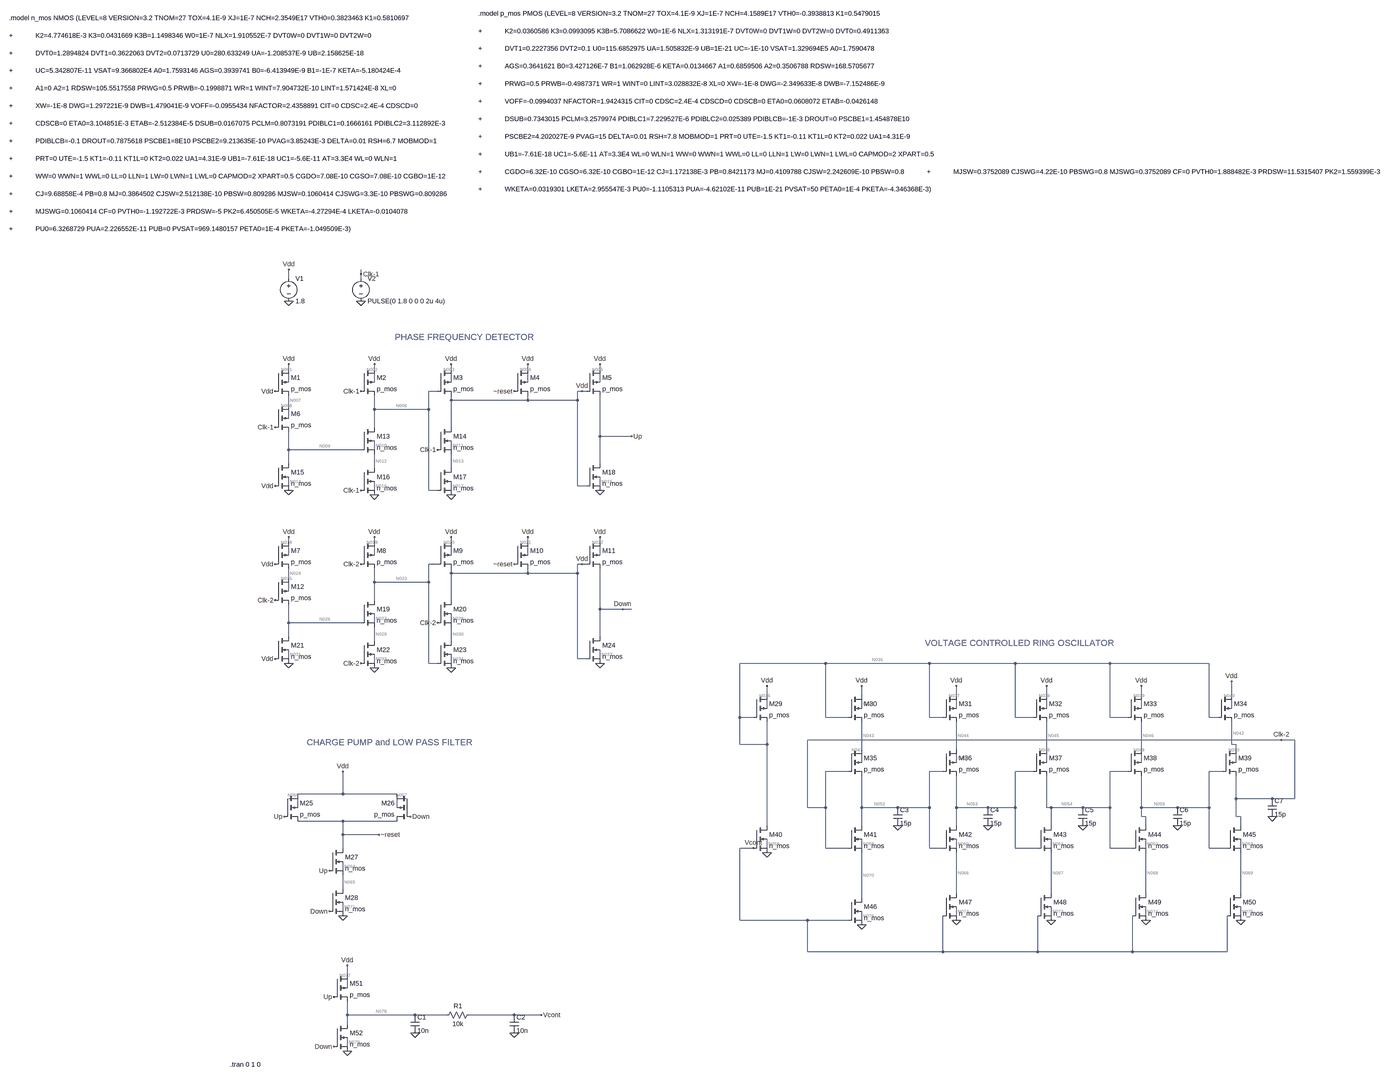
[diagram p0: schematic On-chip_PLL.asc, whole sheet]
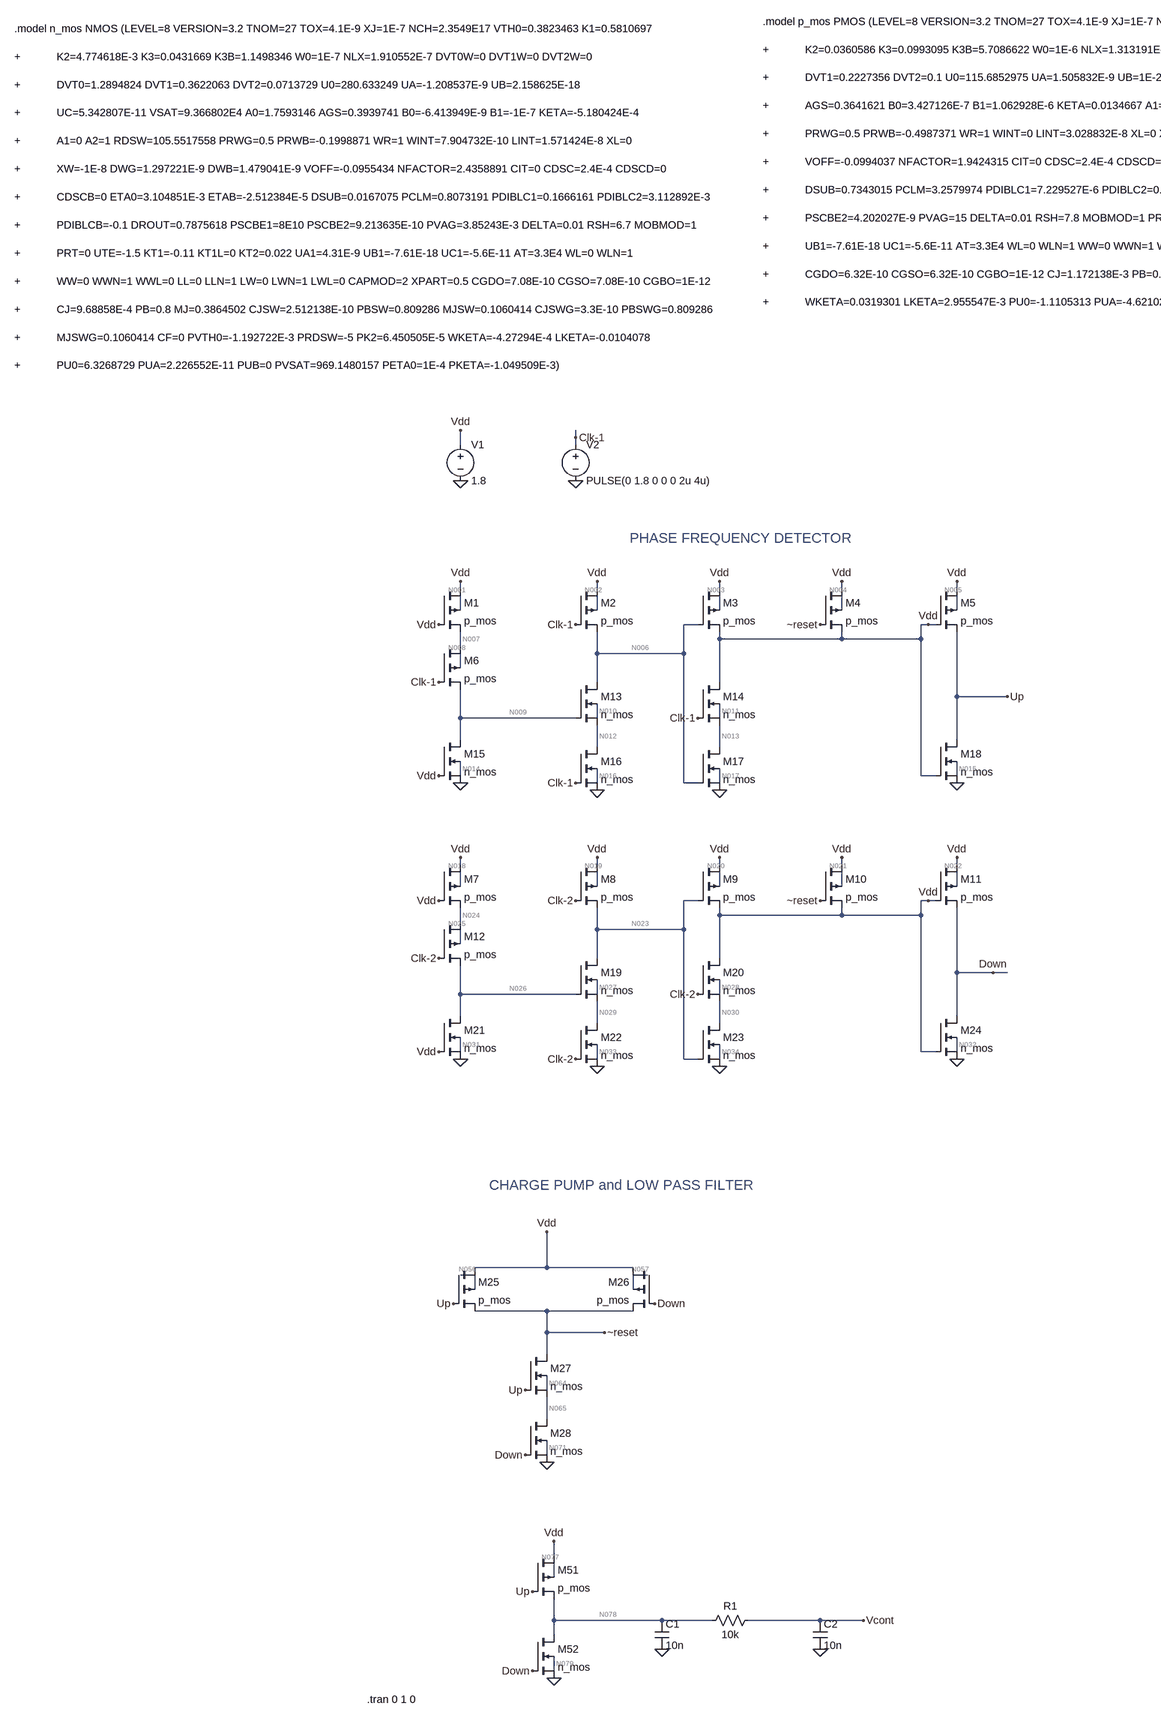
[diagram p1: schematic On-chip_PLL.asc, part, row 1 of 1, column 1 of 2]
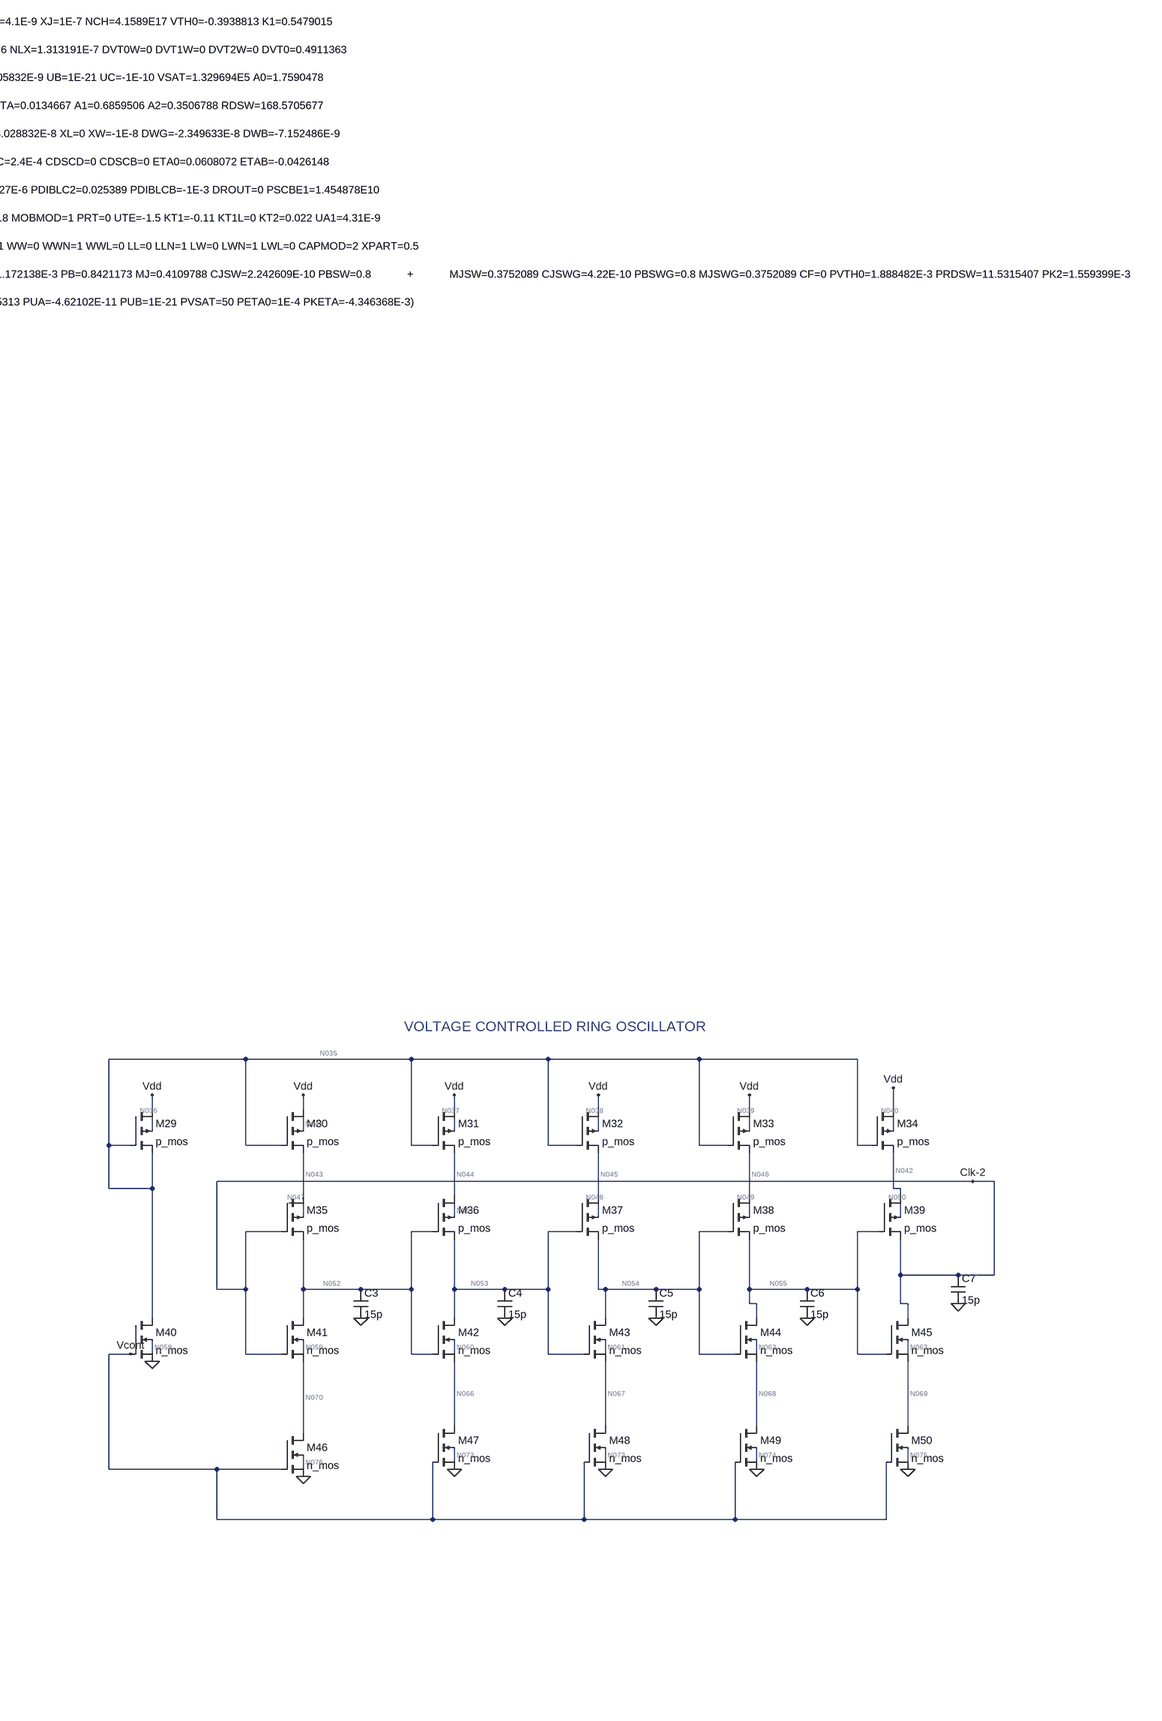
[diagram p2: schematic On-chip_PLL.asc, part, row 1 of 1, column 2 of 2]
On-chip_PLL.asc, the LTspice schematic file:
Version 4
SHEET 1 3912 2176
WIRE 80 -704 80 -720
WIRE -176 -688 -176 -720
WIRE 80 -688 80 -704
WIRE -176 -368 -176 -384
WIRE 128 -368 128 -384
WIRE 400 -368 400 -384
WIRE 672 -368 672 -384
WIRE 928 -368 928 -384
WIRE -176 -352 -192 -352
WIRE 128 -352 112 -352
WIRE 400 -352 384 -352
WIRE 672 -352 656 -352
WIRE 928 -352 912 -352
WIRE -176 -320 -176 -352
WIRE 128 -320 128 -352
WIRE 400 -320 400 -352
WIRE 672 -320 672 -352
WIRE 928 -320 928 -352
WIRE 352 -288 320 -288
WIRE 864 -288 848 -288
WIRE 880 -288 864 -288
WIRE 400 -256 400 -272
WIRE 672 -256 672 -272
WIRE 672 -256 400 -256
WIRE 848 -256 848 -288
WIRE 848 -256 672 -256
WIRE -176 -240 -176 -272
WIRE -176 -224 -192 -224
WIRE 128 -224 128 -272
WIRE 320 -224 320 -288
WIRE 320 -224 128 -224
WIRE -176 -192 -176 -224
WIRE 128 -160 128 -224
WIRE 400 -160 400 -256
WIRE 928 -128 928 -272
WIRE 1040 -128 928 -128
WIRE -176 -80 -176 -144
WIRE 80 -80 -176 -80
WIRE 128 -80 128 -112
WIRE 128 -80 112 -80
WIRE 400 -80 400 -112
WIRE 400 -80 384 -80
WIRE -176 -32 -176 -80
WIRE 928 -32 928 -128
WIRE 128 -16 128 -64
WIRE 400 -16 400 -64
WIRE -176 48 -176 16
WIRE -176 48 -192 48
WIRE 848 48 848 -256
WIRE 880 48 848 48
WIRE 928 48 928 16
WIRE 928 48 912 48
WIRE 128 64 128 32
WIRE 128 64 112 64
WIRE 320 64 320 -224
WIRE 352 64 320 64
WIRE 400 64 400 32
WIRE 400 64 384 64
WIRE -176 304 -176 288
WIRE 128 304 128 288
WIRE 400 304 400 288
WIRE 672 304 672 288
WIRE 928 304 928 288
WIRE -176 320 -192 320
WIRE 128 320 112 320
WIRE 400 320 384 320
WIRE 672 320 656 320
WIRE 928 320 912 320
WIRE -176 352 -176 320
WIRE 128 352 128 320
WIRE 400 352 400 320
WIRE 672 352 672 320
WIRE 928 352 928 320
WIRE 352 384 320 384
WIRE 864 384 848 384
WIRE 880 384 864 384
WIRE 400 416 400 400
WIRE 672 416 672 400
WIRE 672 416 400 416
WIRE 848 416 848 384
WIRE 848 416 672 416
WIRE -176 432 -176 400
WIRE -176 448 -192 448
WIRE 128 448 128 400
WIRE 320 448 320 384
WIRE 320 448 128 448
WIRE -176 480 -176 448
WIRE 128 512 128 448
WIRE 400 512 400 416
WIRE 928 544 928 400
WIRE 1008 544 928 544
WIRE 1040 544 1008 544
WIRE -176 592 -176 528
WIRE 80 592 -176 592
WIRE 128 592 128 560
WIRE 128 592 112 592
WIRE 400 592 400 560
WIRE 400 592 384 592
WIRE -176 640 -176 592
WIRE 928 640 928 544
WIRE 128 656 128 608
WIRE 400 656 400 608
WIRE -176 720 -176 688
WIRE -176 720 -192 720
WIRE 848 720 848 416
WIRE 880 720 848 720
WIRE 928 720 928 688
WIRE 928 720 912 720
WIRE 128 736 128 704
WIRE 128 736 112 736
WIRE 320 736 320 448
WIRE 352 736 320 736
WIRE 400 736 400 704
WIRE 400 736 384 736
WIRE 1728 736 1424 736
WIRE 2096 736 1728 736
WIRE 2400 736 2096 736
WIRE 2736 736 2400 736
WIRE 3088 736 2736 736
WIRE 1520 848 1520 816
WIRE 1856 848 1856 816
WIRE 2192 848 2192 816
WIRE 2512 848 2512 816
WIRE 2848 848 2848 816
WIRE 3168 848 3168 800
WIRE 1520 864 1504 864
WIRE 2192 864 2176 864
WIRE 2512 864 2496 864
WIRE 2848 864 2832 864
WIRE 3168 864 3152 864
WIRE 1520 896 1520 864
WIRE 1856 896 1856 864
WIRE 2192 896 2192 864
WIRE 2512 896 2512 864
WIRE 2848 896 2848 864
WIRE 3168 896 3168 864
WIRE 1424 928 1424 736
WIRE 1472 928 1424 928
WIRE 1728 928 1728 736
WIRE 1808 928 1728 928
WIRE 2096 928 2096 736
WIRE 2144 928 2096 928
WIRE 2400 928 2400 736
WIRE 2464 928 2400 928
WIRE 2736 928 2736 736
WIRE 2800 928 2736 928
WIRE 3088 928 3088 736
WIRE 3120 928 3088 928
WIRE 3344 1008 1664 1008
WIRE 3392 1008 3344 1008
WIRE 1424 1024 1424 928
WIRE 1520 1024 1520 944
WIRE 1520 1024 1424 1024
WIRE 3168 1024 3168 944
WIRE 3184 1024 3168 1024
WIRE 1856 1040 1856 944
WIRE 2192 1040 2192 944
WIRE 2512 1040 2512 944
WIRE 2848 1040 2848 944
WIRE 3184 1040 3184 1024
WIRE 1856 1056 1824 1056
WIRE 2512 1056 2496 1056
WIRE 2848 1056 2832 1056
WIRE 3184 1056 3168 1056
WIRE 1856 1088 1856 1056
WIRE 2192 1088 2192 1056
WIRE 2512 1088 2512 1056
WIRE 2848 1088 2848 1056
WIRE 3184 1088 3184 1056
WIRE 1808 1120 1728 1120
WIRE 2144 1120 2096 1120
WIRE 2464 1120 2400 1120
WIRE 2800 1120 2736 1120
WIRE 3136 1120 3088 1120
WIRE 16 1200 16 1120
WIRE 16 1200 -144 1200
WIRE 208 1200 16 1200
WIRE -144 1216 -176 1216
WIRE 240 1216 208 1216
WIRE 3184 1216 3184 1136
WIRE 3312 1216 3184 1216
WIRE 3392 1216 3392 1008
WIRE 3392 1216 3312 1216
WIRE -144 1248 -144 1216
WIRE 208 1248 208 1216
WIRE 1664 1248 1664 1008
WIRE 1728 1248 1728 1120
WIRE 1728 1248 1664 1248
WIRE 1856 1248 1856 1136
WIRE 1984 1248 1856 1248
WIRE 2096 1248 2096 1120
WIRE 2096 1248 1984 1248
WIRE 2192 1248 2192 1136
WIRE 2304 1248 2192 1248
WIRE 2400 1248 2400 1120
WIRE 2400 1248 2304 1248
WIRE 2512 1248 2512 1136
WIRE 2528 1248 2512 1248
WIRE 2640 1248 2528 1248
WIRE 2736 1248 2736 1120
WIRE 2736 1248 2640 1248
WIRE 2848 1248 2848 1136
WIRE 2976 1248 2848 1248
WIRE 3088 1248 3088 1120
WIRE 3088 1248 2976 1248
WIRE 2848 1280 2848 1248
WIRE 2864 1280 2848 1280
WIRE 3184 1280 3184 1216
WIRE 3200 1280 3184 1280
WIRE 16 1296 -144 1296
WIRE 208 1296 16 1296
WIRE 1520 1312 1520 1024
WIRE 1856 1312 1856 1248
WIRE 2192 1312 2192 1248
WIRE 2528 1312 2528 1248
WIRE 2864 1312 2864 1280
WIRE 3200 1312 3200 1280
WIRE 16 1344 16 1296
WIRE 144 1344 16 1344
WIRE 16 1392 16 1344
WIRE 1472 1392 1424 1392
WIRE 1520 1392 1520 1360
WIRE 1520 1392 1504 1392
WIRE 1728 1392 1728 1248
WIRE 1808 1392 1728 1392
WIRE 1856 1392 1856 1360
WIRE 1856 1392 1840 1392
WIRE 2096 1392 2096 1248
WIRE 2144 1392 2096 1392
WIRE 2192 1392 2192 1360
WIRE 2192 1392 2176 1392
WIRE 2400 1392 2400 1248
WIRE 2480 1392 2400 1392
WIRE 2528 1392 2528 1360
WIRE 2528 1392 2512 1392
WIRE 2736 1392 2736 1248
WIRE 2816 1392 2736 1392
WIRE 2864 1392 2864 1360
WIRE 2864 1392 2848 1392
WIRE 3088 1392 3088 1248
WIRE 3152 1392 3088 1392
WIRE 3200 1392 3200 1360
WIRE 3200 1392 3184 1392
WIRE 16 1472 16 1440
WIRE 16 1536 16 1488
WIRE 2192 1552 2192 1408
WIRE 2528 1552 2528 1408
WIRE 2864 1552 2864 1408
WIRE 3200 1552 3200 1408
WIRE 1856 1568 1856 1408
WIRE 16 1616 16 1584
WIRE 2192 1632 2192 1600
WIRE 2192 1632 2176 1632
WIRE 2528 1632 2528 1600
WIRE 2528 1632 2512 1632
WIRE 2864 1632 2864 1600
WIRE 2864 1632 2848 1632
WIRE 3200 1632 3200 1600
WIRE 3200 1632 3184 1632
WIRE 1424 1648 1424 1392
WIRE 1664 1648 1424 1648
WIRE 1808 1648 1664 1648
WIRE 1856 1648 1856 1616
WIRE 1856 1648 1840 1648
WIRE 1664 1760 1664 1648
WIRE 2144 1760 2144 1632
WIRE 2144 1760 1664 1760
WIRE 2480 1760 2480 1632
WIRE 2480 1760 2144 1760
WIRE 2816 1760 2816 1632
WIRE 2816 1760 2480 1760
WIRE 3152 1760 3152 1632
WIRE 3152 1760 2816 1760
WIRE 32 1840 32 1808
WIRE 32 1856 16 1856
WIRE 32 1888 32 1856
WIRE 32 1984 32 1936
WIRE 272 1984 32 1984
WIRE 384 1984 272 1984
WIRE 624 1984 464 1984
WIRE 720 1984 624 1984
WIRE 32 2016 32 1984
WIRE 32 2096 32 2064
FLAG 1008 544 Down
FLAG 80 -704 Clk-1
FLAG -224 -160 Clk-1
FLAG 80 -288 Clk-1
FLAG 80 64 Clk-1
FLAG 352 -80 Clk-1
FLAG -224 512 Clk-2
FLAG 80 736 Clk-2
FLAG 80 384 Clk-2
FLAG 352 592 Clk-2
FLAG -224 720 Vdd
FLAG -224 384 Vdd
FLAG -224 48 Vdd
FLAG -224 -288 Vdd
FLAG -176 288 Vdd
FLAG 128 288 Vdd
FLAG 400 288 Vdd
FLAG -176 -384 Vdd
FLAG 128 -384 Vdd
FLAG 400 -384 Vdd
FLAG 672 -384 Vdd
FLAG 928 -384 Vdd
FLAG 864 -288 Vdd
FLAG 672 288 Vdd
FLAG 928 288 Vdd
FLAG 864 384 Vdd
FLAG 624 -288 ~reset
FLAG 624 384 ~reset
FLAG -176 -720 Vdd
FLAG -192 1280 Up
FLAG -32 1472 Up
FLAG -32 1616 Down
FLAG 144 1344 ~reset
FLAG 16 1120 Vdd
FLAG 1520 816 Vdd
FLAG 1856 816 Vdd
FLAG 2192 816 Vdd
FLAG 2512 816 Vdd
FLAG 2848 816 Vdd
FLAG 3168 800 Vdd
FLAG 3344 1008 Clk-2
FLAG 1472 1392 Vcont
FLAG 16 1632 0
FLAG -16 2096 Down
FLAG 720 1984 Vcont
FLAG 32 2112 0
FLAG 272 2048 0
FLAG 624 2048 0
FLAG -176 64 0
FLAG 128 80 0
FLAG 400 80 0
FLAG 928 64 0
FLAG -176 736 0
FLAG 128 752 0
FLAG 400 752 0
FLAG 928 736 0
FLAG 1520 1408 0
FLAG 1856 1664 0
FLAG 2192 1648 0
FLAG 2528 1648 0
FLAG 2864 1648 0
FLAG 3200 1648 0
FLAG -176 -608 0
FLAG 80 -608 0
FLAG 1040 -128 Up
FLAG 256 1280 Down
FLAG -16 1920 Up
FLAG 32 1808 Vdd
FLAG 1984 1312 0
FLAG 2304 1312 0
FLAG 2640 1312 0
FLAG 2976 1312 0
FLAG 3312 1280 0
SYMBOL pmos4 -224 -368 R0
SYMATTR InstName M1
SYMATTR Value p_mos
SYMBOL pmos4 80 -368 R0
SYMATTR InstName M2
SYMATTR Value p_mos
SYMBOL pmos4 352 -368 R0
SYMATTR InstName M3
SYMATTR Value p_mos
SYMBOL pmos4 624 -368 R0
SYMATTR InstName M4
SYMATTR Value p_mos
SYMBOL pmos4 880 -368 R0
SYMATTR InstName M5
SYMATTR Value p_mos
SYMBOL pmos4 -224 -240 R0
SYMATTR InstName M6
SYMATTR Value p_mos
SYMBOL nmos4 80 -160 R0
SYMATTR InstName M13
SYMATTR Value n_mos
SYMBOL nmos4 352 -160 R0
SYMATTR InstName M14
SYMATTR Value n_mos
SYMBOL nmos4 -224 -32 R0
SYMATTR InstName M15
SYMATTR Value n_mos
SYMBOL nmos4 80 -16 R0
SYMATTR InstName M16
SYMATTR Value n_mos
SYMBOL nmos4 352 -16 R0
SYMATTR InstName M17
SYMATTR Value n_mos
SYMBOL nmos4 880 -32 R0
SYMATTR InstName M18
SYMATTR Value n_mos
SYMBOL pmos4 -224 304 R0
SYMATTR InstName M7
SYMATTR Value p_mos
SYMBOL pmos4 80 304 R0
SYMATTR InstName M8
SYMATTR Value p_mos
SYMBOL pmos4 352 304 R0
SYMATTR InstName M9
SYMATTR Value p_mos
SYMBOL pmos4 624 304 R0
SYMATTR InstName M10
SYMATTR Value p_mos
SYMBOL pmos4 880 304 R0
SYMATTR InstName M11
SYMATTR Value p_mos
SYMBOL pmos4 -224 432 R0
SYMATTR InstName M12
SYMATTR Value p_mos
SYMBOL nmos4 80 512 R0
SYMATTR InstName M19
SYMATTR Value n_mos
SYMBOL nmos4 352 512 R0
SYMATTR InstName M20
SYMATTR Value n_mos
SYMBOL nmos4 -224 640 R0
SYMATTR InstName M21
SYMATTR Value n_mos
SYMBOL nmos4 80 656 R0
SYMATTR InstName M22
SYMATTR Value n_mos
SYMBOL nmos4 352 656 R0
SYMATTR InstName M23
SYMATTR Value n_mos
SYMBOL nmos4 880 640 R0
SYMATTR InstName M24
SYMATTR Value n_mos
SYMBOL voltage -176 -704 R0
WINDOW 123 0 0 Left 0
WINDOW 39 0 0 Left 0
SYMATTR InstName V1
SYMATTR Value 1.8
SYMBOL voltage 80 -704 R0
WINDOW 123 0 0 Left 0
WINDOW 39 0 0 Left 0
SYMATTR InstName V2
SYMATTR Value PULSE(0 1.8 0 0 0 2u 4u)
SYMBOL pmos4 -192 1200 R0
SYMATTR InstName M25
SYMATTR Value p_mos
SYMBOL nmos4 -32 1392 R0
SYMATTR InstName M27
SYMATTR Value n_mos
SYMBOL nmos4 -32 1536 R0
SYMATTR InstName M28
SYMATTR Value n_mos
SYMBOL pmos4 1472 848 R0
SYMATTR InstName M29
SYMATTR Value p_mos
SYMBOL pmos4 1808 848 R0
SYMATTR InstName M30
SYMATTR Value p_mos
SYMBOL pmos4 2144 848 R0
SYMATTR InstName M31
SYMATTR Value p_mos
SYMBOL pmos4 2464 848 R0
SYMATTR InstName M32
SYMATTR Value p_mos
SYMBOL pmos4 2800 848 R0
SYMATTR InstName M33
SYMATTR Value p_mos
SYMBOL pmos4 3120 848 R0
SYMATTR InstName M34
SYMATTR Value p_mos
SYMBOL pmos4 1808 1040 R0
SYMATTR InstName M35
SYMATTR Value p_mos
SYMBOL pmos4 2144 1040 R0
SYMATTR InstName M36
SYMATTR Value p_mos
SYMBOL pmos4 2464 1040 R0
SYMATTR InstName M37
SYMATTR Value p_mos
SYMBOL pmos4 2800 1040 R0
SYMATTR InstName M38
SYMATTR Value p_mos
SYMBOL pmos4 3136 1040 R0
SYMATTR InstName M39
SYMATTR Value p_mos
SYMBOL nmos4 1472 1312 R0
SYMATTR InstName M40
SYMATTR Value n_mos
SYMBOL nmos4 1808 1312 R0
SYMATTR InstName M41
SYMATTR Value n_mos
SYMBOL nmos4 2144 1312 R0
SYMATTR InstName M42
SYMATTR Value n_mos
SYMBOL nmos4 2480 1312 R0
SYMATTR InstName M43
SYMATTR Value n_mos
SYMBOL nmos4 2816 1312 R0
SYMATTR InstName M44
SYMATTR Value n_mos
SYMBOL nmos4 3152 1312 R0
SYMATTR InstName M45
SYMATTR Value n_mos
SYMBOL nmos4 1808 1568 R0
SYMATTR InstName M46
SYMATTR Value n_mos
SYMBOL nmos4 2144 1552 R0
SYMATTR InstName M47
SYMATTR Value n_mos
SYMBOL nmos4 2480 1552 R0
SYMATTR InstName M48
SYMATTR Value n_mos
SYMBOL nmos4 2816 1552 R0
SYMATTR InstName M49
SYMATTR Value n_mos
SYMBOL nmos4 3152 1552 R0
SYMATTR InstName M50
SYMATTR Value n_mos
SYMBOL nmos4 -16 2016 R0
SYMATTR InstName M52
SYMATTR Value n_mos
SYMBOL cap 256 1984 R0
SYMATTR InstName C1
SYMATTR Value 10n
SYMBOL cap 608 1984 R0
SYMATTR InstName C2
SYMATTR Value 10n
SYMBOL res 480 1968 R90
WINDOW 0 0 56 VBottom 2
WINDOW 3 32 56 VTop 2
SYMATTR InstName R1
SYMATTR Value 10k
SYMBOL pmos4 256 1200 M0
SYMATTR InstName M26
SYMATTR Value p_mos
SYMBOL pmos4 -16 1840 R0
SYMATTR InstName M51
SYMATTR Value p_mos
SYMBOL cap 1968 1248 R0
SYMATTR InstName C3
SYMATTR Value 15p
SYMBOL cap 2288 1248 R0
SYMATTR InstName C4
SYMATTR Value 15p
SYMBOL cap 2624 1248 R0
SYMATTR InstName C5
SYMATTR Value 15p
SYMBOL cap 2960 1248 R0
SYMATTR InstName C6
SYMATTR Value 15p
SYMBOL cap 3296 1216 R0
SYMATTR InstName C7
SYMATTR Value 15p
TEXT 200 -480 Left 3 ;PHASE FREQUENCY DETECTOR
TEXT -112 1016 Left 3 ;CHARGE PUMP and LOW PASS FILTER
TEXT 2080 664 Left 3 ;VOLTAGE CONTROLLED RING OSCILLATOR
TEXT -384 2160 Left 2 !.tran 0 1 0
TEXT -1168 -1848 Left 2 !.model n_mos NMOS (LEVEL=8 VERSION=3.2 TNOM=27 TOX=4.1E-9 XJ=1E-7 NCH=2.3549E17 VTH0=0.3823463 K1=0.5810697 \n \n+            K2=4.774618E-3 K3=0.0431669 K3B=1.1498346 W0=1E-7 NLX=1.910552E-7 DVT0W=0 DVT1W=0 DVT2W=0 \n \n+            DVT0=1.2894824 DVT1=0.3622063 DVT2=0.0713729 U0=280.633249 UA=-1.208537E-9 UB=2.158625E-18\n \n+            UC=5.342807E-11 VSAT=9.366802E4 A0=1.7593146 AGS=0.3939741 B0=-6.413949E-9 B1=-1E-7 KETA=-5.180424E-4\n \n+            A1=0 A2=1 RDSW=105.5517558 PRWG=0.5 PRWB=-0.1998871 WR=1 WINT=7.904732E-10 LINT=1.571424E-8 XL=0\n \n+            XW=-1E-8 DWG=1.297221E-9 DWB=1.479041E-9 VOFF=-0.0955434 NFACTOR=2.4358891 CIT=0 CDSC=2.4E-4 CDSCD=0\n \n+            CDSCB=0 ETA0=3.104851E-3 ETAB=-2.512384E-5 DSUB=0.0167075 PCLM=0.8073191 PDIBLC1=0.1666161 PDIBLC2=3.112892E-3    \n \n+            PDIBLCB=-0.1 DROUT=0.7875618 PSCBE1=8E10 PSCBE2=9.213635E-10 PVAG=3.85243E-3 DELTA=0.01 RSH=6.7 MOBMOD=1\n \n+            PRT=0 UTE=-1.5 KT1=-0.11 KT1L=0 KT2=0.022 UA1=4.31E-9 UB1=-7.61E-18 UC1=-5.6E-11 AT=3.3E4 WL=0 WLN=1\n \n+            WW=0 WWN=1 WWL=0 LL=0 LLN=1 LW=0 LWN=1 LWL=0 CAPMOD=2 XPART=0.5 CGDO=7.08E-10 CGSO=7.08E-10 CGBO=1E-12\n \n+            CJ=9.68858E-4 PB=0.8 MJ=0.3864502 CJSW=2.512138E-10 PBSW=0.809286 MJSW=0.1060414 CJSWG=3.3E-10 PBSWG=0.809286 \n \n+            MJSWG=0.1060414 CF=0 PVTH0=-1.192722E-3 PRDSW=-5 PK2=6.450505E-5 WKETA=-4.27294E-4 LKETA=-0.0104078 \n \n+            PU0=6.3268729 PUA=2.226552E-11 PUB=0 PVSAT=969.1480157 PETA0=1E-4 PKETA=-1.049509E-3)
TEXT 496 -1864 Left 2 !.model p_mos PMOS (LEVEL=8 VERSION=3.2 TNOM=27 TOX=4.1E-9 XJ=1E-7 NCH=4.1589E17 VTH0=-0.3938813 K1=0.5479015\n \n+            K2=0.0360586 K3=0.0993095 K3B=5.7086622 W0=1E-6 NLX=1.313191E-7 DVT0W=0 DVT1W=0 DVT2W=0 DVT0=0.4911363\n \n+            DVT1=0.2227356 DVT2=0.1 U0=115.6852975 UA=1.505832E-9 UB=1E-21 UC=-1E-10 VSAT=1.329694E5 A0=1.7590478\n \n+            AGS=0.3641621 B0=3.427126E-7 B1=1.062928E-6 KETA=0.0134667 A1=0.6859506 A2=0.3506788 RDSW=168.5705677\n \n+            PRWG=0.5 PRWB=-0.4987371 WR=1 WINT=0 LINT=3.028832E-8 XL=0 XW=-1E-8 DWG=-2.349633E-8 DWB=-7.152486E-9 \n \n+            VOFF=-0.0994037 NFACTOR=1.9424315 CIT=0 CDSC=2.4E-4 CDSCD=0 CDSCB=0 ETA0=0.0608072 ETAB=-0.0426148\n \n+            DSUB=0.7343015 PCLM=3.2579974 PDIBLC1=7.229527E-6 PDIBLC2=0.025389 PDIBLCB=-1E-3 DROUT=0 PSCBE1=1.454878E10\n \n+            PSCBE2=4.202027E-9 PVAG=15 DELTA=0.01 RSH=7.8 MOBMOD=1 PRT=0 UTE=-1.5 KT1=-0.11 KT1L=0 KT2=0.022 UA1=4.31E-9\n \n+            UB1=-7.61E-18 UC1=-5.6E-11 AT=3.3E4 WL=0 WLN=1 WW=0 WWN=1 WWL=0 LL=0 LLN=1 LW=0 LWN=1 LWL=0 CAPMOD=2 XPART=0.5\n \n+            CGDO=6.32E-10 CGSO=6.32E-10 CGBO=1E-12 CJ=1.172138E-3 PB=0.8421173 MJ=0.4109788 CJSW=2.242609E-10 PBSW=0.8            +            MJSW=0.3752089 CJSWG=4.22E-10 PBSWG=0.8 MJSWG=0.3752089 CF=0 PVTH0=1.888482E-3 PRDSW=11.5315407 PK2=1.559399E-3    \n \n+            WKETA=0.0319301 LKETA=2.955547E-3 PU0=-1.1105313 PUA=-4.62102E-11 PUB=1E-21 PVSAT=50 PETA0=1E-4 PKETA=-4.346368E-3)

The netlist it stands for:
* On-chip_PLL.asc
M1 Vdd Vdd N007 N001 p_mos
M2 Vdd Clk-1 N006 N002 p_mos
M3 Vdd N006 Vdd N003 p_mos
M4 Vdd ~reset Vdd N004 p_mos
M5 Vdd Vdd Up N005 p_mos
M6 N007 Clk-1 N009 N008 p_mos
M13 N006 N009 N012 N010 n_mos
M14 Vdd Clk-1 N013 N011 n_mos
M15 N009 Vdd 0 N014 n_mos
M16 N012 Clk-1 0 N016 n_mos
M17 N013 N006 0 N017 n_mos
M18 Up Vdd 0 N015 n_mos
M7 Vdd Vdd N024 N018 p_mos
M8 Vdd Clk-2 N023 N019 p_mos
M9 Vdd N023 Vdd N020 p_mos
M10 Vdd ~reset Vdd N021 p_mos
M11 Vdd Vdd Down N022 p_mos
M12 N024 Clk-2 N026 N025 p_mos
M19 N023 N026 N029 N027 n_mos
M20 Vdd Clk-2 N030 N028 n_mos
M21 N026 Vdd 0 N031 n_mos
M22 N029 Clk-2 0 N033 n_mos
M23 N030 N023 0 N034 n_mos
M24 Down Vdd 0 N032 n_mos
V1 Vdd 0 1.8
V2 Clk-1 0 PULSE(0 1.8 0 0 0 2u 4u)
M25 Vdd Up ~reset N056 p_mos
M27 ~reset Up N065 N064 n_mos
M28 N065 Down 0 N071 n_mos
M29 Vdd N035 N035 N036 p_mos
M30 Vdd N035 N043 N041 p_mos
M31 Vdd N035 N044 N037 p_mos
M32 Vdd N035 N045 N038 p_mos
M33 Vdd N035 N046 N039 p_mos
M34 Vdd N035 N042 N040 p_mos
M35 N043 Clk-2 N052 N047 p_mos
M36 N044 N052 N053 N051 p_mos
M37 N045 N053 N054 N048 p_mos
M38 N046 N054 N055 N049 p_mos
M39 N042 N055 Clk-2 N050 p_mos
M40 N035 Vcont 0 N058 n_mos
M41 N052 Clk-2 N070 N059 n_mos
M42 N053 N052 N066 N060 n_mos
M43 N054 N053 N067 N061 n_mos
M44 N055 N054 N068 N062 n_mos
M45 Clk-2 N055 N069 N063 n_mos
M46 N070 Vcont 0 N076 n_mos
M47 N066 Vcont 0 N072 n_mos
M48 N067 Vcont 0 N073 n_mos
M49 N068 Vcont 0 N074 n_mos
M50 N069 Vcont 0 N075 n_mos
M52 N078 Down 0 N079 n_mos
C1 N078 0 10n
C2 Vcont 0 10n
R1 Vcont N078 10k
M26 Vdd Down ~reset N057 p_mos
M51 Vdd Up N078 N077 p_mos
C3 N052 0 15p
C4 N053 0 15p
C5 N054 0 15p
C6 N055 0 15p
C7 Clk-2 0 15p
.model NMOS NMOS
.model PMOS PMOS
.lib standard.mos
* PHASE FREQUENCY DETECTOR
* CHARGE PUMP and LOW PASS FILTER
* VOLTAGE CONTROLLED RING OSCILLATOR
.tran 0 1 0
.model n_mos NMOS (LEVEL=8 VERSION=3.2 TNOM=27 TOX=4.1E-9 XJ=1E-7 NCH=2.3549E17 VTH0=0.3823463 K1=0.5810697
+            K2=4.774618E-3 K3=0.0431669 K3B=1.1498346 W0=1E-7 NLX=1.910552E-7 DVT0W=0 DVT1W=0 DVT2W=0
+            DVT0=1.2894824 DVT1=0.3622063 DVT2=0.0713729 U0=280.633249 UA=-1.208537E-9 UB=2.158625E-18
+            UC=5.342807E-11 VSAT=9.366802E4 A0=1.7593146 AGS=0.3939741 B0=-6.413949E-9 B1=-1E-7 KETA=-5.180424E-4
+            A1=0 A2=1 RDSW=105.5517558 PRWG=0.5 PRWB=-0.1998871 WR=1 WINT=7.904732E-10 LINT=1.571424E-8 XL=0
+            XW=-1E-8 DWG=1.297221E-9 DWB=1.479041E-9 VOFF=-0.0955434 NFACTOR=2.4358891 CIT=0 CDSC=2.4E-4 CDSCD=0
+            CDSCB=0 ETA0=3.104851E-3 ETAB=-2.512384E-5 DSUB=0.0167075 PCLM=0.8073191 PDIBLC1=0.1666161 PDIBLC2=3.112892E-3
+            PDIBLCB=-0.1 DROUT=0.7875618 PSCBE1=8E10 PSCBE2=9.213635E-10 PVAG=3.85243E-3 DELTA=0.01 RSH=6.7 MOBMOD=1
+            PRT=0 UTE=-1.5 KT1=-0.11 KT1L=0 KT2=0.022 UA1=4.31E-9 UB1=-7.61E-18 UC1=-5.6E-11 AT=3.3E4 WL=0 WLN=1
+            WW=0 WWN=1 WWL=0 LL=0 LLN=1 LW=0 LWN=1 LWL=0 CAPMOD=2 XPART=0.5 CGDO=7.08E-10 CGSO=7.08E-10 CGBO=1E-12
+            CJ=9.68858E-4 PB=0.8 MJ=0.3864502 CJSW=2.512138E-10 PBSW=0.809286 MJSW=0.1060414 CJSWG=3.3E-10 PBSWG=0.809286
+            MJSWG=0.1060414 CF=0 PVTH0=-1.192722E-3 PRDSW=-5 PK2=6.450505E-5 WKETA=-4.27294E-4 LKETA=-0.0104078
+            PU0=6.3268729 PUA=2.226552E-11 PUB=0 PVSAT=969.1480157 PETA0=1E-4 PKETA=-1.049509E-3)
.model p_mos PMOS (LEVEL=8 VERSION=3.2 TNOM=27 TOX=4.1E-9 XJ=1E-7 NCH=4.1589E17 VTH0=-0.3938813 K1=0.5479015
+            K2=0.0360586 K3=0.0993095 K3B=5.7086622 W0=1E-6 NLX=1.313191E-7 DVT0W=0 DVT1W=0 DVT2W=0 DVT0=0.4911363
+            DVT1=0.2227356 DVT2=0.1 U0=115.6852975 UA=1.505832E-9 UB=1E-21 UC=-1E-10 VSAT=1.329694E5 A0=1.7590478
+            AGS=0.3641621 B0=3.427126E-7 B1=1.062928E-6 KETA=0.0134667 A1=0.6859506 A2=0.3506788 RDSW=168.5705677
+            PRWG=0.5 PRWB=-0.4987371 WR=1 WINT=0 LINT=3.028832E-8 XL=0 XW=-1E-8 DWG=-2.349633E-8 DWB=-7.152486E-9
+            VOFF=-0.0994037 NFACTOR=1.9424315 CIT=0 CDSC=2.4E-4 CDSCD=0 CDSCB=0 ETA0=0.0608072 ETAB=-0.0426148
+            DSUB=0.7343015 PCLM=3.2579974 PDIBLC1=7.229527E-6 PDIBLC2=0.025389 PDIBLCB=-1E-3 DROUT=0 PSCBE1=1.454878E10
+            PSCBE2=4.202027E-9 PVAG=15 DELTA=0.01 RSH=7.8 MOBMOD=1 PRT=0 UTE=-1.5 KT1=-0.11 KT1L=0 KT2=0.022 UA1=4.31E-9
+            UB1=-7.61E-18 UC1=-5.6E-11 AT=3.3E4 WL=0 WLN=1 WW=0 WWN=1 WWL=0 LL=0 LLN=1 LW=0 LWN=1 LWL=0 CAPMOD=2 XPART=0.5
+            CGDO=6.32E-10 CGSO=6.32E-10 CGBO=1E-12 CJ=1.172138E-3 PB=0.8421173 MJ=0.4109788 CJSW=2.242609E-10 PBSW=0.8            +            MJSW=0.3752089 CJSWG=4.22E-10 PBSWG=0.8 MJSWG=0.3752089 CF=0 PVTH0=1.888482E-3 PRDSW=11.5315407 PK2=1.559399E-3
+            WKETA=0.0319301 LKETA=2.955547E-3 PU0=-1.1105313 PUA=-4.62102E-11 PUB=1E-21 PVSAT=50 PETA0=1E-4 PKETA=-4.346368E-3)
.backanno
.end

* Results of the author's LTspice run, read from the files saved beside the schematic
* Operating Point, zero values left out:
*   V(vdd) = 1.8 V
*   V(n007) = 51.08 mV
*   V(n001) = 1.651 V
*   V(n006) = 1.8 V
*   V(n002) = 1.689 V
*   V(n003) = 1.689 V
*   V(~reset) = 1.8 V
*   V(n004) = 1.689 V
*   V(up) = 36.79 nV
*   V(n005) = 1.651 V
*   V(n009) = 36.41 nV
*   V(n008) = 22.03 mV
*   V(n012) = 50.93 mV
*   V(n010) = 177.6 mV
*   V(n013) = 79.56 nV
*   V(n011) = 128.4 mV
*   V(n014) = 13.38 nV
*   V(n016) = 16.46 mV
*   V(n017) = 29.24 nV
*   V(n015) = 13.52 nV
*   V(n024) = 697.4 mV
*   V(n018) = 1.657 V
*   V(clk-2) = 690.3 mV
*   V(n023) = 1.8 V
*   V(n019) = 1.689 V
*   V(n020) = 1.689 V
*   V(n021) = 1.689 V
*   V(down) = 36.79 nV
*   V(n022) = 1.651 V
*   V(n026) = 30.74 nV
*   V(n025) = 576.9 mV
*   V(n029) = 335.2 nV
*   V(n027) = 128.4 mV
*   V(n030) = 30.42 mV
*   V(n028) = 157.8 mV
*   V(n031) = 11.3 nV
*   V(n033) = 123.2 nV
*   V(n034) = 10.31 mV
*   V(n032) = 13.52 nV
*   V(n056) = 1.689 V
*   V(n065) = 50.93 mV
*   V(n064) = 177.6 mV
*   V(n071) = 16.46 mV
*   V(n035) = 123.3 mV
*   V(n036) = 1.652 V
*   V(n043) = 1.663 V
*   V(n041) = 1.669 V
*   V(n044) = 1.663 V
*   V(n037) = 1.669 V
*   V(n045) = 1.663 V
*   V(n038) = 1.669 V
*   V(n046) = 1.663 V
*   V(n039) = 1.669 V
*   V(n042) = 1.663 V
*   V(n040) = 1.669 V
*   V(n052) = 690.3 mV
*   V(n047) = 1.523 V
*   V(n053) = 690.3 mV
*   V(n051) = 1.523 V
*   V(n054) = 690.3 mV
*   V(n048) = 1.523 V
*   V(n055) = 690.3 mV
*   V(n049) = 1.523 V
*   V(n050) = 1.523 V
*   V(vcont) = 1.8 V
*   V(n058) = 34.84 mV
*   V(n070) = 28.51 mV
*   V(n059) = 122.1 mV
*   V(n066) = 28.51 mV
*   V(n060) = 122.1 mV
*   V(n067) = 28.51 mV
*   V(n061) = 122.1 mV
*   V(n068) = 28.51 mV
*   V(n062) = 122.1 mV
*   V(n069) = 28.51 mV
*   V(n063) = 122.1 mV
*   V(n076) = 9.709 mV
*   V(n072) = 9.709 mV
*   V(n073) = 9.709 mV
*   V(n074) = 9.709 mV
*   V(n075) = 9.709 mV
*   V(n078) = 1.8 V
*   V(n079) = 128.4 mV
*   V(n057) = 1.689 V
*   V(n077) = 1.689 V
*   Id(M52) = 26.96 pA
*   Is(M52) = -26.84 pA
*   Id(M50) = 9.518 µA
*   Is(M50) = -9.518 µA
*   Id(M49) = 9.518 µA
*   Is(M49) = -9.518 µA
*   Id(M48) = 9.518 µA
*   Is(M48) = -9.518 µA
*   Id(M47) = 9.518 µA
*   Is(M47) = -9.518 µA
*   Id(M46) = 9.518 µA
*   Is(M46) = -9.518 µA
*   Id(M45) = 9.518 µA
*   Is(M45) = -9.518 µA
*   Id(M44) = 9.518 µA
*   Is(M44) = -9.518 µA
*   Id(M43) = 9.518 µA
*   Is(M43) = -9.518 µA
*   Id(M42) = 9.518 µA
*   Is(M42) = -9.518 µA
*   Id(M41) = 9.518 µA
*   Is(M41) = -9.518 µA
*   Id(M40) = 39.63 µA
*   Is(M40) = -39.63 µA
*   Id(M28) = 7.991 pA
*   Is(M28) = -7.975 pA
*   Id(M27) = 8.169 pA
*   Is(M27) = -7.991 pA
*   Id(M24) = 12.41 pA
*   Is(M24) = -12.41 pA
*   Id(M23) = 10.15 µA
*   Is(M23) = -10.15 µA
*   Id(M22) = 26.84 pA
*   Is(M22) = -26.84 pA
*   Id(M21) = 10.37 pA
*   Is(M21) = -10.37 pA
*   Id(M20) = 10.15 µA
*   Is(M20) = -10.15 µA
*   Id(M19) = 26.96 pA
*   Is(M19) = -26.84 pA
*   Id(M18) = 12.41 pA
*   Is(M18) = -12.41 pA
*   Id(M17) = 26.84 pA
*   Is(M17) = -26.84 pA
*   Id(M16) = 7.991 pA
*   Is(M16) = -7.975 pA
*   Id(M15) = 12.28 pA
*   Is(M15) = -12.28 pA
*   Id(M14) = 26.96 pA
*   Is(M14) = -26.84 pA
*   Id(M13) = 8.169 pA
*   Is(M13) = -7.991 pA
*   Id(M51) = 28.65 pA
*   Ib(M51) = -1.689 pA
*   Is(M51) = -26.96 pA
*   Id(M26) = 5.773 pA
*   Ib(M26) = -1.689 pA
*   Is(M26) = -4.084 pA
*   Id(M39) = 9.518 µA
*   Ib(M39) = -1.523 pA
*   Is(M39) = -9.518 µA
*   Id(M38) = 9.518 µA
*   Ib(M38) = -1.523 pA
*   Is(M38) = -9.518 µA
*   Id(M37) = 9.518 µA
*   Ib(M37) = -1.523 pA
*   Is(M37) = -9.518 µA
*   Id(M36) = 9.518 µA
*   Ib(M36) = -1.523 pA
*   Is(M36) = -9.518 µA
*   Id(M35) = 9.518 µA
*   Ib(M35) = -1.523 pA
*   Is(M35) = -9.518 µA
*   Id(M34) = 9.518 µA
*   Ib(M34) = -1.669 pA
*   Is(M34) = -9.518 µA
*   Id(M33) = 9.518 µA
*   Ib(M33) = -1.669 pA
*   Is(M33) = -9.518 µA
*   Id(M32) = 9.518 µA
*   Ib(M32) = -1.669 pA
*   Is(M32) = -9.518 µA
*   Id(M31) = 9.518 µA
*   Ib(M31) = -1.669 pA
*   Is(M31) = -9.518 µA
*   Id(M30) = 9.518 µA
*   Ib(M30) = -1.669 pA
*   Is(M30) = -9.518 µA
*   Id(M29) = 39.63 µA
*   Ib(M29) = -1.652 pA
*   Is(M29) = -39.63 µA
*   Id(M25) = 5.773 pA
*   Ib(M25) = -1.689 pA
*   Is(M25) = -4.084 pA
*   Id(M12) = 10.94 pA
*   Is(M12) = -10.37 pA
*   Id(M11) = 14.06 pA
*   Ib(M11) = -1.651 pA
*   Is(M11) = -12.41 pA
*   Ib(M10) = -1.689 pA
*   Ib(M9) = -1.689 pA
*   Id(M8) = 28.65 pA
*   Ib(M8) = -1.689 pA
*   Is(M8) = -26.96 pA
*   Id(M7) = 12.6 pA
*   Ib(M7) = -1.657 pA
*   Is(M7) = -10.94 pA
*   Id(M6) = 12.3 pA
*   Is(M6) = -12.28 pA
*   Id(M5) = 14.06 pA
*   Ib(M5) = -1.651 pA
*   Is(M5) = -12.41 pA
*   Ib(M4) = -1.689 pA
*   Ib(M3) = -1.689 pA
*   Id(M2) = 9.858 pA
*   Ib(M2) = -1.689 pA
*   Is(M2) = -8.169 pA
*   Id(M1) = 13.96 pA
*   Ib(M1) = -1.651 pA
*   Is(M1) = -12.3 pA
*   I(V1) = -97.37 µA